# EAGLE design reduktor light (EAGLE 6.3)
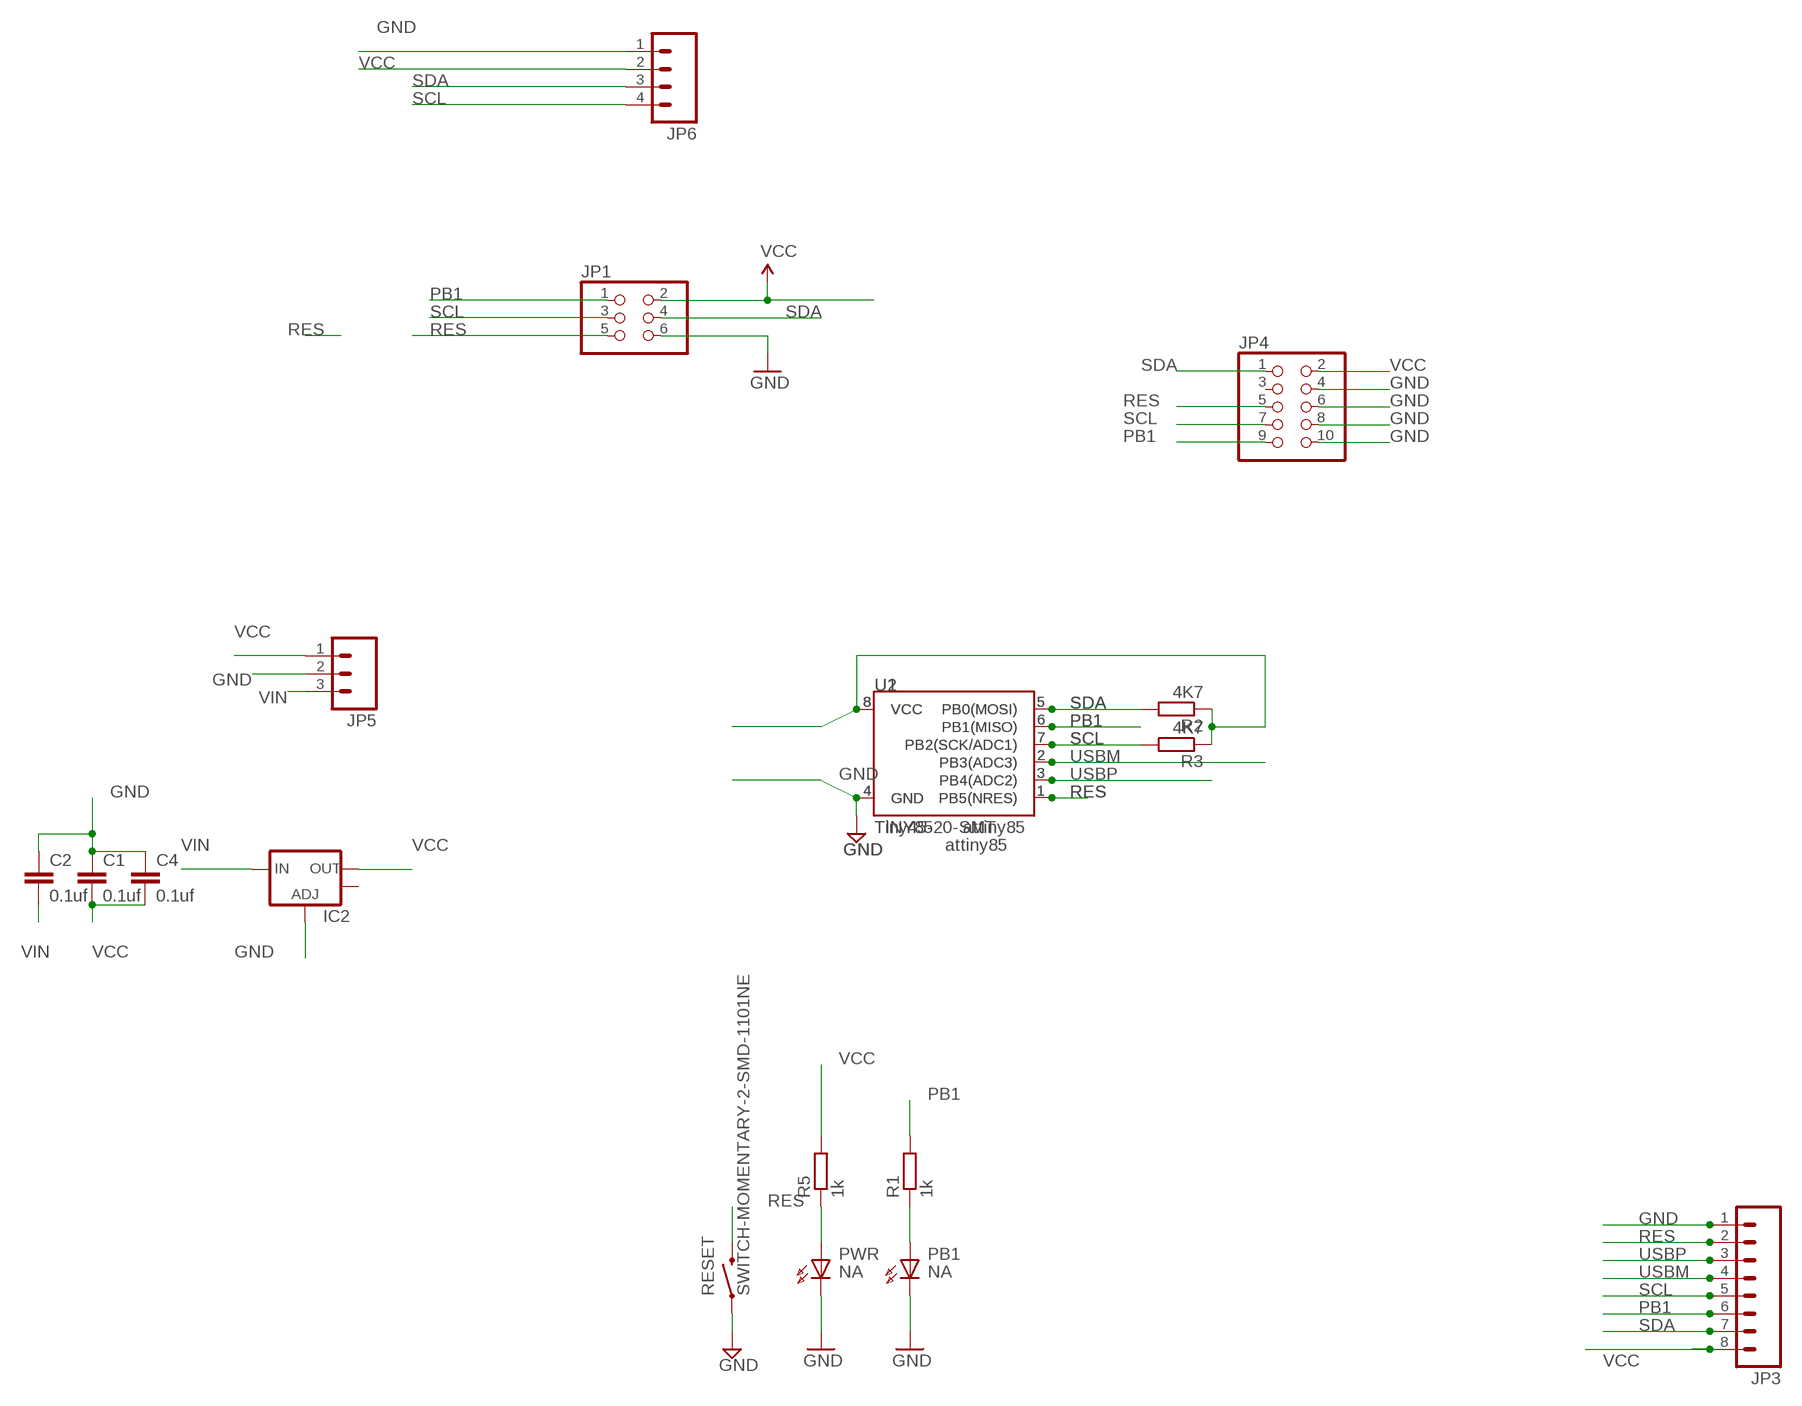
[diagram p0: schematic, sheet 1]

## Parts
C1  0.1uf  CAP0603-CAP  [0603-CAP]
C2  0.1uf  CAP0603-CAP  [0603-CAP]
C4  0.1uf  CAP0603-CAP  [0603-CAP]
IC2  V_REG_LM1117SOT223  [SOT223]
JP1  PINHD-2X3  [2X03]
JP3  M08LOCK_LONGPADS  [1X08_LOCK_LONGPADS]
JP4  PINHD-2X5  [2X05]
JP5  M03LONGPADS  [1X03_LONGPADS]
JP6  M04PTH  [1X04]
PB1  NA  LED0603DWS  [LED-0603]
PWR  NA  LED0603DWS  [LED-0603]
R1  1k  R-EU_R0603  [R0603]
R2  4K7  R-EU_R0603  [R0603]
R3  4K7  R-EU_R0603  [R0603]
R5  1k  R-EU_R0603  [R0603]
RESET  SWITCH-MOMENTARY-2-SMD-1101NE  [TACTILE-SWITCH-1101NE]
U1  TINY85  ATTINY45TINY45-20-DIP  [DIP08]
U2  Tiny45-20-SMT  ATTINY45TINY45-20-SMT  [SO08-EIAJ]

## Nets
GND: C1.1 C2.1 C4.1 IC2.1(ADJ) JP1.6 JP3.1 JP4.4 JP4.6 JP4.8 JP4.10 JP5.2 JP6.1 PB1.C PWR.C RESET.P$1 U1.4(GND) U2.4(GND)
N$3 [pwr]: PWR.A R5.1
PB1: JP1.1 JP3.6 JP4.9 R1.2 U1.6(PB1(MISO)) U2.6(PB1(MISO))
PIN1R: PB1.A R1.1
RES: JP1.5 JP3.2 JP4.5 RESET.P$2 U1.1(PB5(NRES)) U2.1(PB5(NRES))
SCL: JP1.3 JP3.5 JP4.7 JP6.4 R3.2 U1.7(PB2(SCK/ADC1)) U2.7(PB2(SCK/ADC1))
SDA: JP1.4 JP3.7 JP4.1 JP6.3 R2.2 U1.5(PB0(MOSI)) U2.5(PB0(MOSI))
USBM: JP3.4 U1.2(PB3(ADC3)) U2.2(PB3(ADC3))
USBP: JP3.3 U1.3(PB4(ADC2)) U2.3(PB4(ADC2))
VCC [pwr]: C1.2 C4.2 IC2.2(OUT) JP1.2 JP3.8 JP4.2 JP5.1 JP6.2 R2.1 R3.1 R5.2 U1.8(VCC) U2.8(VCC)
VIN: C2.2 IC2.3(IN) JP5.3
Unconnected: IC2.4(OUT) JP4.3

## Notes on the sheet
- attiny85
- attiny85

## Library data of the parts
C1 C2 C4 = SparkFun:CAP: Capacitor Standard 0603 ceramic capacitor, and 0.1" leaded capacitor.
IC2 = SparkFun:V_REG_LM1117: Voltage Regulator LM1117 Standard adjustable voltage regulator but in SMD form. Spark Fun Electronics SKU : COM-00595
JP1 = pinhead:PINHD-2X3: PIN HEADER
JP3 = SparkFun:M08: Header 8 Standard 8-pin 0.1" header. Use with straight break away headers (SKU : PRT-00116), right angle break away headers (PRT-00553), swiss pins (PRT-00743), machine pins (PRT-00117), and female headers (PRT-00115).
JP4 = pinhead:PINHD-2X5: PIN HEADER
JP5 = SparkFun:M03: Header 3 Standard 3-pin 0.1" header. Use with straight break away headers (SKU : PRT-00116), right angle break away headers (PRT-00553), swiss pins (PRT-00743), machine pins (PRT-00117), and female headers (PRT-00115). Molex polarized connector foot print use with SKU : PRT-08232 with associated crimp pins and housings.
JP6 = SparkFun:M04: Header 4 Standard 4-pin 0.1" header. Use with straight break away headers (SKU : PRT-00116), right angle break away headers (PRT-00553), swiss pins (PRT-00743), machine pins (PRT-00117), and female headers (PRT-00115). Molex polarized connector foot print use with SKU : PRT-08231 with associated crimp pins and housings. 1MM SMD Version SKU: PRT-10208
PB1 PWR = DOUBLE-SIDE:LED
R1-R3 R5 = rcl:R-EU_: RESISTOR, European symbol
RESET = SparkFun:SWITCH-MOMENTARY-2
U1 = SparkFun-DigitalIC:ATTINY45: Atmel 8-pin 2/4/8kB flash uC; PROD_ID: IC-09439; VALUE: TINY45-20-DIP
U2 = SparkFun-DigitalIC:ATTINY45: Atmel 8-pin 2/4/8kB flash uC; PROD_ID: IC-08922

## Net classes
0 default: width 0.254 mm, drill 0.356 mm, clearance 0.254 mm
1 GND: width 0.254 mm, drill 0.356 mm, clearance 0.254 mm
2 pwr: width 0.254 mm, drill 0.356 mm, clearance 0.254 mm

## Board
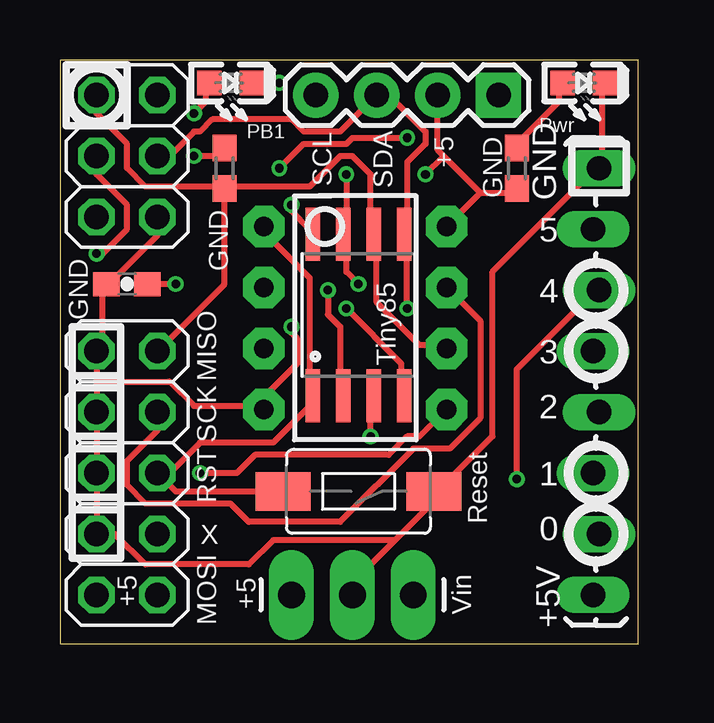
[diagram p1: board, top side]
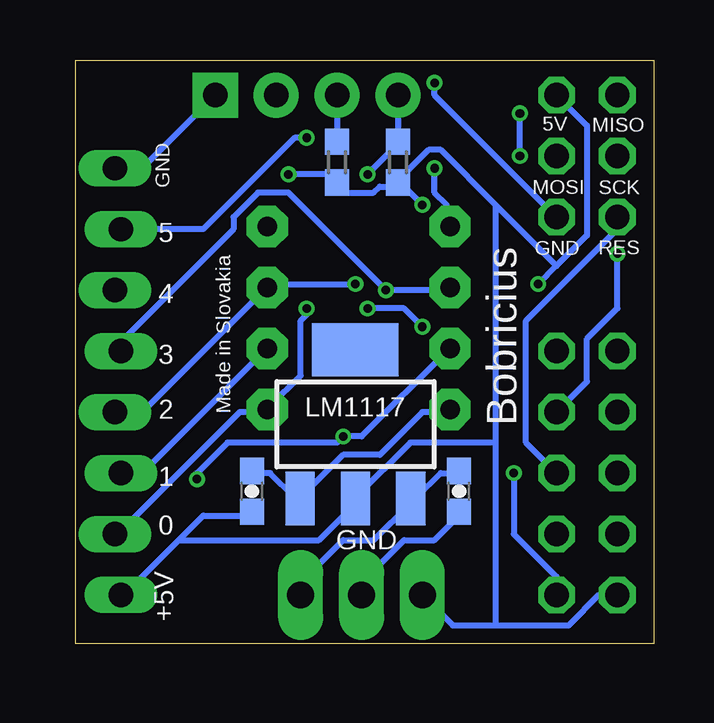
[diagram p2: board, bottom side, seen from below]

Size 24.11 x 24.33 mm. Coordinates in mm from the lower left corner, seen from the top.
Outline: 0,24.33 0,0 24.11,0 24.11,24.33 0,24.33
Copper layers (1*16): Top 0.035mm / dielectric 1.5mm / Bottom 0.035mm
Design rules "ITEADstudio_DRC": minimum track width 6mil, minimum drill 12mil, track to track 6mil, track to pad 6mil, pad to pad 6mil, via to via 6mil, smd to smd 0mil, copper to edge 10mil, drill to drill 10mil, minimum pad ring 10mil, minimum via ring 6mil, stop-mask expansion 2mil, vias tented up to drill 100mil, thermal gap 10mil

### Footprints (pad centres in the part's own frame; a part is rotated, then mirrored left to right if it is on the bottom)
0603-CAP = smd 1.1 x 1: 1 -0.85,0; 2 0.85,0
SOT223 = smd 1.219 x 2.235: 1 -2.311,-3.099; 2 0,-3.099; 3 2.311,-3.099 | smd 3.6 x 2.2: 4 0,3.099
2X03 = drill 1.016 octagon: 1 -2.54,-1.27; 2 -2.54,1.27; 3 0,-1.27; 4 0,1.27; 5 2.54,-1.27; 6 2.54,1.27
1X08_LOCK_LONGPADS = drill 1.016 long: 1 0,0.127; 2 2.54,-0.127; 3 5.08,0.127; 4 7.62,-0.127; 5 10.16,0.127; 6 12.7,-0.127; 7 15.24,0.127; 8 17.78,-0.127
2X05 = drill 1.016 octagon: 1 -5.08,-1.27; 2 -5.08,1.27; 3 -2.54,-1.27; 4 -2.54,1.27; 5 0,-1.27; 6 0,1.27; 7 2.54,-1.27; 8 2.54,1.27; 9 5.08,-1.27; 10 5.08,1.27
1X03_LONGPADS = drill 1.118 pad 1.88 long: 1 0,0; 2 2.54,0; 3 5.08,0
1X04 = drill 1.016 pad 1.88 square: 1 0,0 | drill 1.016 pad 1.88: 2 2.54,0; 3 5.08,0; 4 7.62,0
LED-0603 = smd 1.016 x 1.016: A 0.889,0; C -0.889,0
R0603 = smd 1.1 x 1: 1 -0.85,0; 2 0.85,0
TACTILE-SWITCH-1101NE = smd 2.3 x 1.6: P$1 -3.15,0; P$2 3.15,0
DIP08 = drill 0.813 pad 1.727 octagon: 1 -3.81,-3.81; 2 -1.27,-3.81; 3 1.27,-3.81; 4 3.81,-3.81; 5 3.81,3.81; 6 1.27,3.81; 7 -1.27,3.81; 8 -3.81,3.81
SO08-EIAJ = smd 0.61 x 2.21: 1 -1.905,-3.378; 2 -0.635,-3.378; 3 0.635,-3.378; 4 1.905,-3.378; 5 1.905,3.353; 6 0.635,3.353; 7 -0.635,3.353; 8 -1.905,3.353

### Placement (x,y rotation side)
C1  16.76,6.35 270 bottom
C2  8.13,6.35 90 bottom
C4  2.79,14.99 0 top
IC2  12.45,9.15 0 bottom
JP1  2.79,20.32 270 top
JP3  22.35,19.82 270 top
JP4  2.79,7.12 90 top
JP5  9.65,2.04 0 top
JP6  18.29,22.86 180 top
PB1  7.11,23.37 180 top
PWR  21.84,23.37 180 top
R1  6.86,19.82 270 top
R2  13.21,20.07 90 bottom
R3  10.67,20.07 90 bottom
R5  19.05,19.82 270 top
RESET  12.45,6.35 180 top
U1  12.31,13.58 270 top
U2  12.45,13.72 0 top

### Tracks (layer width: path | path; a pad name or v marks a point on that pad's centre or on a via)
GND  (via drill 0.36)
  Top 0.254: v11.94,13.97 14.22,11.69 14.22,10.42 U2.4 | v9.65,13.21 9.65,12.96 9.91,12.7 9.91,11.69 8.64,10.42 8.64,9.91 U1.4 8.38,9.91 5.59,9.91 4.57,10.93 1.52,10.93 | v9.14,23.37 PB1.C | 1.52,10.93 JP4.10 1.78,12.45 1.78,14.99 C4.1 2.03,14.99 4.06,17.02 JP1.6 | 1.52,10.93 JP4.8 JP4.6 JP4.4 2.29,4.58 3.56,3.31 7.87,3.31 8.89,4.32 13.97,4.32 | PWR.C 22.61,23.37 22.61,19.82 JP3.1 22.35,19.82 18.03,15.5 18.03,8.64 15.75,6.35 RESET.P$1 15.49,6.35 15.49,5.85 13.97,4.32 | 13.97,4.32 12.19,2.54 JP5.2
  Bottom 0.254: C1.1 16.76,7.12 16,7.12 14.99,6.1 IC2.1 14.73,6.1 12.95,7.88 11.43,7.88 9.65,9.66 8.64,9.66 U1.4 | v11.94,13.97 10.41,13.97 v9.65,13.21 | v9.14,23.37 9.14,22.86 JP1.6 | JP3.1 21.34,19.82 JP6.1 | JP5.2 12.19,2.54 10.41,4.32 9.14,4.32 8.13,5.34 C2.1
N$3
  Top 0.254: PWR.A 20.83,23.37 20.83,22.61 19.05,20.83 R5.1
PB1
  Top 0.254: JP4.9 6.86,14.99 R1.2 6.86,19.05 | JP1.1 1.52,22.1 2.79,20.83 2.79,19.82 3.56,19.05 6.86,19.05 | U1.6 16,12.45 14.99,12.45 13.21,14.23 13.21,17.02 U2.6 12.95,17.28 12.95,19.56 12.19,20.32 11.68,20.32 10.41,19.05 6.86,19.05
  Bottom 0.254: JP3.6 21.34,7.12 16.26,12.2 U1.6
PIN1R  (via drill 0.36)
  Top 0.254: 6.35,23.37 PB1.A 6.1,23.37 6.1,22.61 v5.59,22.1 | v5.59,20.32 6.6,20.32 6.86,20.58 R1.1
  Bottom 0.254: v5.59,20.32 v5.59,22.1
RES  (via drill 0.36)
  Top 0.254: RESET.P$2 4.83,6.35 4.32,6.86 | U1.1 8.38,17.28 10.41,15.24 10.41,10.42 U2.1 10.67,10.16 8.89,8.39 5.84,8.39 4.32,6.86 | v14.48,21.09 12.19,21.09 11.94,20.83 10.16,20.83 v9.14,19.82 | 4.32,6.86 JP4.5
  Bottom 0.254: JP1.5 1.52,17.28 5.33,13.47 5.33,8.39 JP4.5 | JP3.2 18.8,17.28 14.99,21.09 v14.48,21.09 | v9.14,19.82 9.14,18.8 8.64,18.29 8.64,17.53 U1.1
SCL  (via drill 0.36)
  Top 0.254: v11.94,19.56 11.94,17.28 U2.7 11.94,17.02 11.94,15.5 v12.45,14.99 | JP4.7 4.06,8.89 2.79,7.62 2.79,6.61 3.56,5.85 7.11,5.85 7.87,5.08 11.68,5.08 14.73,8.13 16.26,8.13 17.53,9.4 17.53,13.47 16.26,14.74 U1.7 | JP1.3 1.52,19.56 2.79,18.29 2.79,17.28 1.78,16.26 v1.52,16.26
  Bottom 0.254: JP6.4 R3.2 10.67,20.83 v11.94,19.56 | JP3.5 21.34,9.66 16.26,14.74 U1.7 16,14.99 v12.45,14.99 | v1.52,16.26 1.52,13.97 2.79,12.7 2.79,10.93 JP4.7
SDA  (via drill 0.36)
  Top 0.254: JP1.4 4.57,20.32 5.59,21.34 5.84,21.34 6.35,21.85 9.65,21.85 10.16,21.34 11.68,21.34 JP6.3 13.72,22.86 15.24,21.34 15.24,20.83 14.48,20.07 14.48,17.28 U2.5 14.48,17.02 v14.48,13.97 | v5.84,7.12 7.37,7.12 8.13,7.88 13.72,7.88 14.48,8.64 14.99,8.64 16,9.66 U1.5
  Bottom 0.254: JP6.3 R2.2 | JP4.1 4.06,2.8 5.84,4.58 v5.84,7.12 | JP3.7 22.35,4.58 17.27,9.66 16.26,9.66 U1.5 16,9.91 14.73,11.18 14.73,13.47 14.48,13.72 v14.48,13.97
USBM  (via drill 0.36)
  Top 0.254: v11.18,14.74 11.18,13.72 11.68,13.21 11.68,10.42 U2.2
  Bottom 0.254: U1.2 8.64,14.74 v11.18,14.74 15.24,18.8 16.51,18.8 17.53,17.78 17.53,17.28 22.1,12.7 22.1,12.2 JP3.4
USBP  (via drill 0.36)
  Top 0.254: v12.95,8.64 12.95,10.16 U2.3 | v19.05,6.86 19.05,11.43 22.35,14.74 JP3.3
  Bottom 0.254: U1.3 8.64,12.2 12.19,8.64 v12.95,8.64 13.21,8.39 17.78,8.39 19.05,7.12 v19.05,6.86
VCC  (via drill 0.36)
  Top 0.254: 17.53,18.8 19.05,18.8 R5.2 | 17.53,18.8 16.26,17.53 U1.8 | JP6.2 15.75,20.58 16,20.32 | 17.53,18.8 16,20.32 | v4.83,14.99 C4.2 | v9.65,18.29 9.65,18.04 10.41,17.28 U2.8 | v15.24,19.56 16,20.32
  Bottom 0.254: 19.81,4.32 22.1,2.04 JP3.8 | 19.81,4.32 18.8,5.34 16.76,5.34 C1.2 | 19.81,4.32 13.97,4.32 12.45,5.85 IC2.2 12.45,6.1 10.16,8.39 6.6,8.39 | JP4.2 2.29,2.04 3.56,0.77 6.6,0.77 | 6.6,0.77 8.38,0.77 JP5.1 | 4.06,15.75 2.79,17.02 2.79,21.59 JP1.2 | 4.06,15.75 v4.83,14.99 | 10.67,19.31 9.4,20.58 8.89,20.58 6.6,18.29 | 4.06,15.75 6.6,18.29 | 10.67,19.31 v9.65,18.29 | 10.67,19.31 R3.1 10.67,19.05 11.43,19.05 11.68,18.8 12.95,18.8 13.21,19.05 R2.1 13.21,19.31 13.46,19.56 v15.24,19.56 | 6.6,18.29 6.6,8.39 | 6.6,8.39 6.6,0.77
VIN
  Bottom 0.254: C2.2 8.13,7.12 8.89,7.12 9.91,6.1 IC2.3 10.16,5.85 11.68,4.32 12.95,4.32 14.73,2.54 JP5.3

### Text on the board
tNames: PB1 | SCL | SDA | +5 | GND | Pwr | GND | GND | 5 | GND | 4 | Tiny85 | 3 | MISO | 2 | SCK | 1 | RST | Reset | X | 0 | +5 | MOSI | +5 | Vin | +5V
bNames: MISO | 5V | SCK | MOSI | GND | RES | 5 | GND | 4 | 3 | LM1117 | Made in Slovakia | Bobricius | 2 | 1 | 0 | GND | +5V